# EAGLE design video_board_yis503 (EAGLE 7.5.0)
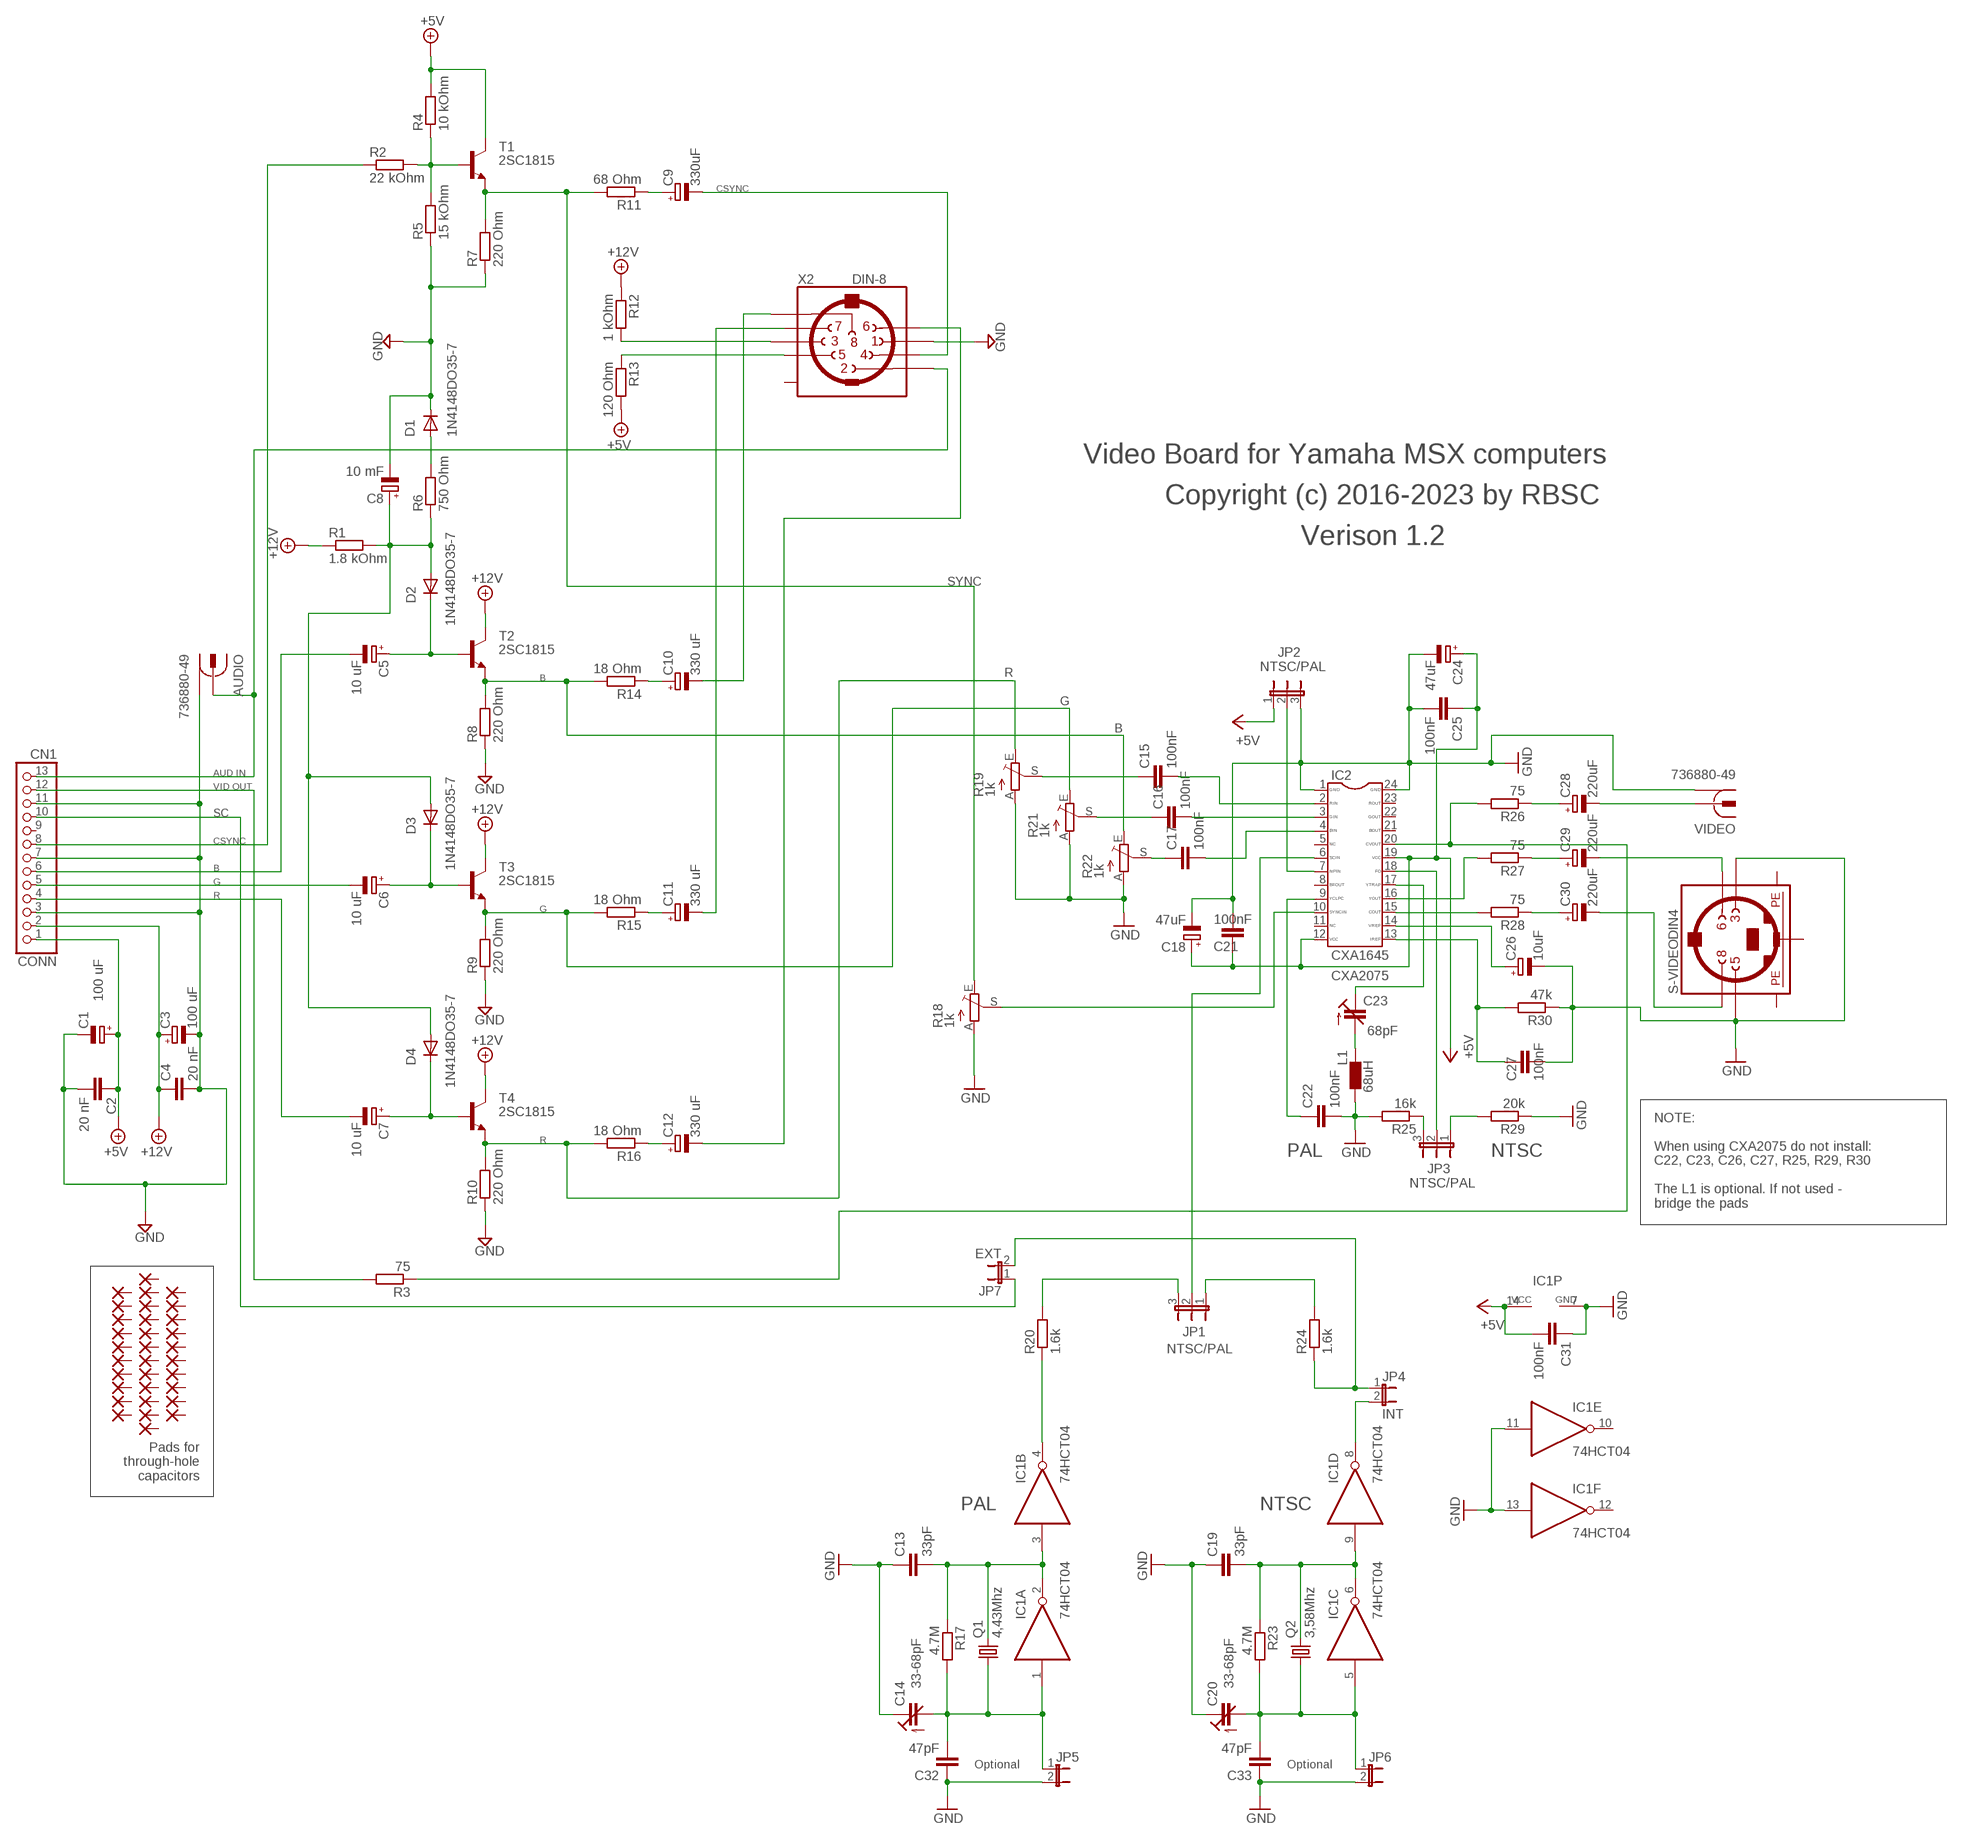
[diagram p0: schematic, sheet 1]

## Parts
AUDIO  736880-49  [736880-49]
C1  100 uF  CPOL-EUSMCD  [SMC_D]
C2  20 nF  C-EUC0805  [C0805]
C3  100 uF  CPOL-EUSMCD  [SMC_D]
C4  20 nF  C-EUC0805  [C0805]
C5  10 uF  CPOL-EUSMCB  [SMC_B]
C6  10 uF  CPOL-EUSMCB  [SMC_B]
C7  10 uF  CPOL-EUSMCB  [SMC_B]
C8  10 mF  CPOL-EUSMCB  [SMC_B]
C9  330uF  CPOL-EUSMCD  [SMC_D]
C10  330 uF  CPOL-EUSMCD  [SMC_D]
C11  330 uF  CPOL-EUSMCD  [SMC_D]
C12  330 uF  CPOL-EUSMCD  [SMC_D]
C13  33pF  C-EUC0805  [C0805]
C14  33-68pF  C-TRIMMTZ03  [CTRIMTZ03]
C15  100nF  C-EUC0805  [C0805]
C16  100nF  C-EUC0805  [C0805]
C17  100nF  C-EUC0805  [C0805]
C18  47uF  CPOL-EUSMCB  [SMC_B]
C19  33pF  C-EUC0805  [C0805]
C20  33-68pF  C-TRIMMTZ03  [CTRIMTZ03]
C21  100nF  C-EUC0805  [C0805]
C22  100nF  C-EUC0805  [C0805]
C23  68pF  C-TRIMMTZ03  [CTRIMTZ03]
C24  47uF  CPOL-EUSMCB  [SMC_B]
C25  100nF  C-EUC0805  [C0805]
C26  10uF  CPOL-EUSMCB  [SMC_B]
C27  100nF  C-EUC0805  [C0805]
C28  220uF  CPOL-EUSMCD  [SMC_D]
C29  220uF  CPOL-EUSMCD  [SMC_D]
C30  220uF  CPOL-EUSMCD  [SMC_D]
C31  100nF  C-EUC0805  [C0805]
C32  47pF  C-EUC0805  [C0805]
C33  47pF  C-EUC0805  [C0805]
CONN  CN1  PINHD-1X13  [1X13]
D1  1N4148DO35-7  DIODE-MINIMELF  [MINIMELF]
D2  1N4148DO35-7  DIODE-MINIMELF  [MINIMELF]
D3  1N4148DO35-7  DIODE-MINIMELF  [MINIMELF]
D4  1N4148DO35-7  DIODE-MINIMELF  [MINIMELF]
IC1  74HCT04  74HCT04D  [SO14]
IC2  CXA1645  [SOP24]
JP1  NTSC/PAL  JP2E  [JP2]
JP2  NTSC/PAL  JP2E  [JP2]
JP3  NTSC/PAL  JP2E  [JP2]
JP4  INT  JP1E  [JP1]
JP5  JP1E  [JP1]
JP6  JP1E  [JP1]
JP7  EXT  JP1E  [JP1]
L1  68uH  LL3230M  [L3230M]
P1  PADTH  [PADTH]
P2  PADTH  [PADTH]
P3  PADTH  [PADTH]
P4  PADTH  [PADTH]
P5  PADTH  [PADTH]
P6  PADTH  [PADTH]
P7  PADTH  [PADTH]
P8  PADTH  [PADTH]
P9  PADTH  [PADTH]
P10  PADTH  [PADTH]
P11  PADTH  [PADTH]
P12  PADTH  [PADTH]
P13  PADTH  [PADTH]
P14  PADTH  [PADTH]
P15  PADTH  [PADTH]
P16  PADTH  [PADTH]
P17  PADTH  [PADTH]
P18  PADTH  [PADTH]
P19  PADTH  [PADTH]
P20  PADTH  [PADTH]
P21  PADTH  [PADTH]
P22  PADTH  [PADTH]
P23  PADTH  [PADTH]
P24  PADTH  [PADTH]
P25  PADTH  [PADTH]
P26  PADTH  [PADTH]
P27  PADTH  [PADTH]
P28  PADTH  [PADTH]
P29  PADTH  [PADTH]
P30  PADTH  [PADTH]
P31  PADTH  [PADTH]
P32  PADTH  [PADTH]
Q1  4,43Mhz  CRYSTALHC49S  [HC49/S]
Q2  3,58Mhz  CRYSTALHC49S  [HC49/S]
R1  1.8 kOhm  R-EU_R0805  [R0805]
R2  22 kOhm  R-EU_R0805  [R0805]
R3  75  R-EU_R0805  [R0805]
R4  10 kOhm  R-EU_R0805  [R0805]
R5  15 kOhm  R-EU_R0805  [R0805]
R6  750 Ohm  R-EU_R0805  [R0805]
R7  220 Ohm  R-EU_R0805  [R0805]
R8  220 Ohm  R-EU_R0805  [R0805]
R9  220 Ohm  R-EU_R0805  [R0805]
R10  220 Ohm  R-EU_R0805  [R0805]
R11  68 Ohm  R-EU_R0805  [R0805]
R12  1 kOhm  R-EU_R0805  [R0805]
R13  120 Ohm  R-EU_R0805  [R0805]
R14  18 Ohm  R-EU_R0805  [R0805]
R15  18 Ohm  R-EU_R0805  [R0805]
R16  18 Ohm  R-EU_R0805  [R0805]
R17  4.7M  R-EU_R0805  [R0805]
R18  1k  TRIM_EU-CA6V  [CA6V]
R19  1k  TRIM_EU-CA6V  [CA6V]
R20  1.6k  R-EU_R0805  [R0805]
R21  1k  TRIM_EU-CA6V  [CA6V]
R22  1k  TRIM_EU-CA6V  [CA6V]
R23  4.7M  R-EU_R0805  [R0805]
R24  1.6k  R-EU_R0805  [R0805]
R25  16k  R-EU_R0805  [R0805]
R26  75  R-EU_R0805  [R0805]
R27  75  R-EU_R0805  [R0805]
R28  75  R-EU_R0805  [R0805]
R29  20k  R-EU_R0805  [R0805]
R30  47k  R-EU_R0805  [R0805]
S-VIDEO  DIN4  MINI_DIN_4  [M_DIN4]
T1  2SC1815  [TO92-ECB]
T2  2SC1815  [TO92-ECB]
T3  2SC1815  [TO92-ECB]
T4  2SC1815  [TO92-ECB]
VIDEO  736880-49  [736880-49]
X2  DIN-8  [DIN8]

## Nets
+5V: C1.+ C2.1 C18.+ C21.1 C24.+ C25.1 C31.2 CONN.1 IC1.14(P:VCC) IC2.12 IC2.19 JP2.1 R4.2 R13.2 T1.C
+12V: C3.+ C4.1 CONN.2 R1.1 R12.1 T2.C T3.C T4.C
GND: AUDIO.1 AUDIO.1@1 AUDIO.1@2 C1.- C2.2 C3.- C4.2 C8.- C13.1 C14.1(E) C18.- C19.1 C20.1(E) C21.2 C22.2 C24.- C25.2 C26.- C27.2 C31.1 C32.1 C33.1 CONN.3 CONN.7 CONN.11 D1.C IC1.7(P:GND) IC1.11(E:I) IC1.13(F:I) IC2.1 IC2.24 JP2.3 JP5.2 JP6.2 L1.2 R5.1 R7.1 R8.1 R9.1 R10.1 R18.A R19.A R21.A R22.A R25.2 R29.1 R30.1 S-VIDEO.3 S-VIDEO.5 VIDEO.1 VIDEO.1@1 VIDEO.1@2 X2.1
N$1: R10.2 R16.2 R19.E T4.E
N$2: C20.2(A) C33.2 IC1.5(C:I) JP6.1 Q2.1 R23.2
N$3: JP4.1 JP7.2 R24.1
N$4: CONN.8 R2.1
N$5: R8.2 R14.2 R22.E T2.E
N$6: C15.1 R19.S
N$7: C16.1 R21.S
N$8: IC1.4(B:O) R20.1
N$9: C23.2(A) L1.1
N$10: C19.2 IC1.6(C:O) IC1.9(D:I) Q2.2 R23.1
N$11: JP1.3 R20.2
N$12: C8.+ D2.A D3.A D4.A R1.2 R6.1
N$13: JP3.3 R25.1
N$14: IC2.7 JP2.2
N$15: JP3.1 R29.2
N$16: IC2.16 R27.2
N$17: JP1.1 R24.2
N$18: IC1.8(D:O) JP4.2
N$19: CONN.12 R3.2
N$24: C23.1(E) IC2.17
N$26: C12.- X2.6
N$27: C11.- X2.7
N$29: C6.+ D3.C T3.B
N$30: C10.- X2.8
N$31: D1.A R6.2
N$32: C6.- CONN.5
N$33: C5.- CONN.6
N$34: AUDIO.2 CONN.13 X2.2
N$35: C12.+ R16.1
N$36: R12.2 X2.3
N$37: R9.2 R15.2 R21.E T3.E
N$38: R13.1 X2.5
N$39: C7.+ D4.C T4.B
N$42: C7.- CONN.4
N$43: C5.+ D2.C T2.B
N$47: R2.2 R4.1 R5.2 T1.B
N$50: R7.2 R11.2 R18.E T1.E
N$51: C11.+ R15.1
N$52: C10.+ R14.1
N$53: C9.+ R11.1
N$54: C9.- X2.4
N$55: C17.1 R22.S
N$56: C16.2 IC2.3
N$57: C15.2 IC2.2
N$58: C17.2 IC2.4
N$59: C14.2(A) C32.2 IC1.1(A:I) JP5.1 Q1.1 R17.2
N$60: C13.2 IC1.2(A:O) IC1.3(B:I) Q1.2 R17.1
N$61: IC2.10 R18.S
N$63: IC2.6 JP1.2
N$64: IC2.20 R3.1 R26.2
N$65: C22.1 IC2.9
N$66: IC2.18 JP3.2
N$68: IC2.15 R28.2
N$69: C28.+ R26.1
N$70: C29.+ R27.1
N$71: C30.+ R28.1
N$72: C26.+ IC2.14
N$73: C27.1 IC2.13 R30.2
N$75: C28.- VIDEO.2
N$78: C29.- S-VIDEO.6
N$79: C30.- S-VIDEO.8
SC: CONN.10 JP7.1
Unconnected: CONN.9 IC1.10(E:O) IC1.12(F:O) IC2.5 IC2.8 IC2.11 IC2.21 IC2.22 IC2.23 P1.1(P) P2.1(P) P3.1(P) P4.1(P) P5.1(P) P6.1(P) P7.1(P) P8.1(P) P9.1(P) P10.1(P) P11.1(P) P12.1(P) P13.1(P) P14.1(P) P15.1(P) P16.1(P) P17.1(P) P18.1(P) P19.1(P) P20.1(P) P21.1(P) P22.1(P) P23.1(P) P24.1(P) P25.1(P) P26.1(P) P27.1(P) P28.1(P) P29.1(P) P30.1(P) P31.1(P) P32.1(P) X2.GND

## Notes on the sheet
- CSYNC
- Video Board for Yamaha MSX computers
- Copyright (c) 2016-2023 by RBSC
- Verison 1.2
- SYNC
- R
- B
- G
- B
- AUD IN
- VID OUT
- CSYNC
- B
- G
- R
- G
- CXA2075
- R
- PAL | NTSC
- NOTE:
  
  When using CXA2075 do not install:
  C22, C23, C26, C27, R25, R29, R30
  
  The L1 is optional. If not used -
  bridge the pads
- Pads for
  through-hole
  capacitors
- PAL | NTSC
- Optional | Optional

## Power pins joined to a net without a drawn wire
PE1: S-VIDEO.SH1(PE1)
PE2: S-VIDEO.SH2(PE2)
PE3: S-VIDEO.SH3(PE3)

## Library data of the parts
AUDIO VIDEO = con-conrad:736880-49: Cinch Connector ( RCA Jack ) Cinch-Einbaukupplung 90º 72345 Vernickelt BKL Electronic Source: Conrad <http://www.conrad.de/ce/de/product/736880>
C1 C3 C5-C12 = rcl:CPOL-EU: POLARIZED CAPACITOR, European symbol
C2 C4 = rcl:C-EU: CAPACITOR, European symbol
C13 C15-C17 C19 C21 C22 C25 C27 C31-C33 = rcl:C-EU: CAPACITOR, European symbol; OC_FARNELL: unknown
C14 C20 = rcl:C-TRIMM: Trimm capacitor; OC_FARNELL: unknown
C18 C24 C26 C28-C30 = rcl:CPOL-EU: POLARIZED CAPACITOR, European symbol; OC_FARNELL: unknown
C23 = rcl:C-TRIMM: Trimm capacitor
CONN = pinhead:PINHD-1X13: PIN HEADER
D1-D4 = diode:DIODE-: DIODE
IC1 = 74xx-eu:74*04: Hex INVERTER
IC2 = CXA1645M:CXA1645; OC_FARNELL: unknown
JP1-JP3 = jumper:JP2E: JUMPER
JP4-JP7 = jumper:JP1E: JUMPER
L1 = eagle-ltspice:L: INDUCTOR, European symbol; SPICEMODEL: NONE; SPICEPREFIX: L
P1-P32 = combopad:PADTH: THROUGH-HOLE PAD
Q1 Q2 = crystal:CRYSTAL: CRYSTAL; MF: MULTICOMP; MPN: HC49SM-3.6864-30-50-60-16-ATF; OC_FARNELL: 1667008; OC_NEWARK: unknown
R1 R2 R4-R16 = resistor:R-EU_: RESISTOR, European symbol
R3 R17 R20 R23-R30 = rcl:R-EU_: RESISTOR, European symbol; OC_FARNELL: unknown
R18 R19 R21 R22 = pot:TRIM_EU-: POTENTIOMETER; OC_FARNELL: unknown
S-VIDEO = mini_din:MINI_DIN_4
T1-T4 = transistor:2SC1815: NPN EPITAXIAL TRANSISTOR Source: TOSHIBA .. 2SC1815 1.pdf
X2 = din8:DIN-8: Female CONNECTOR 8 pins with shield, horizontal (DIN 41524)

## Board
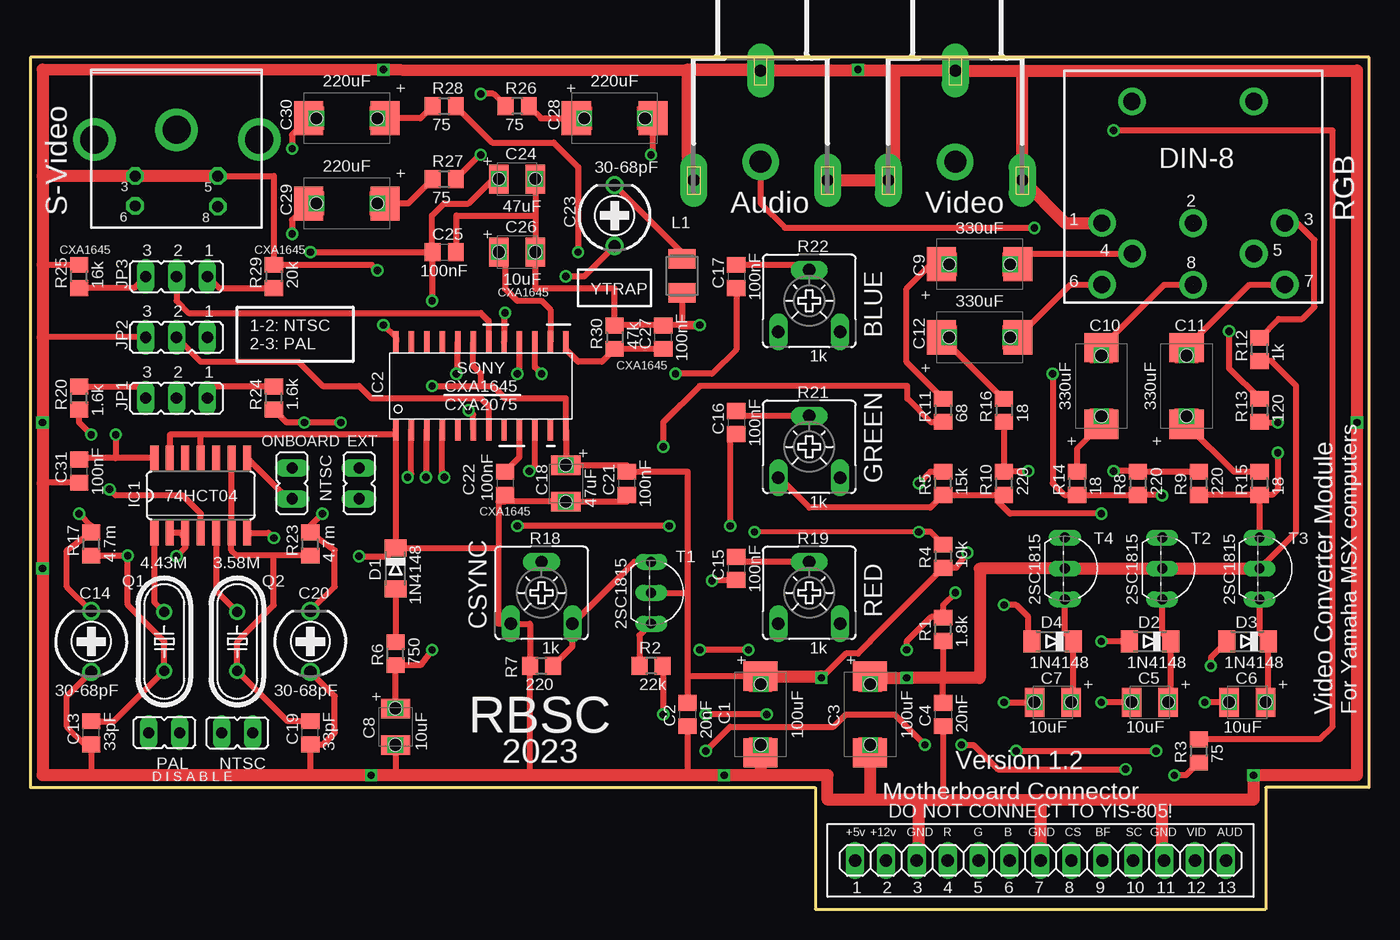
[diagram p1: board, top side]
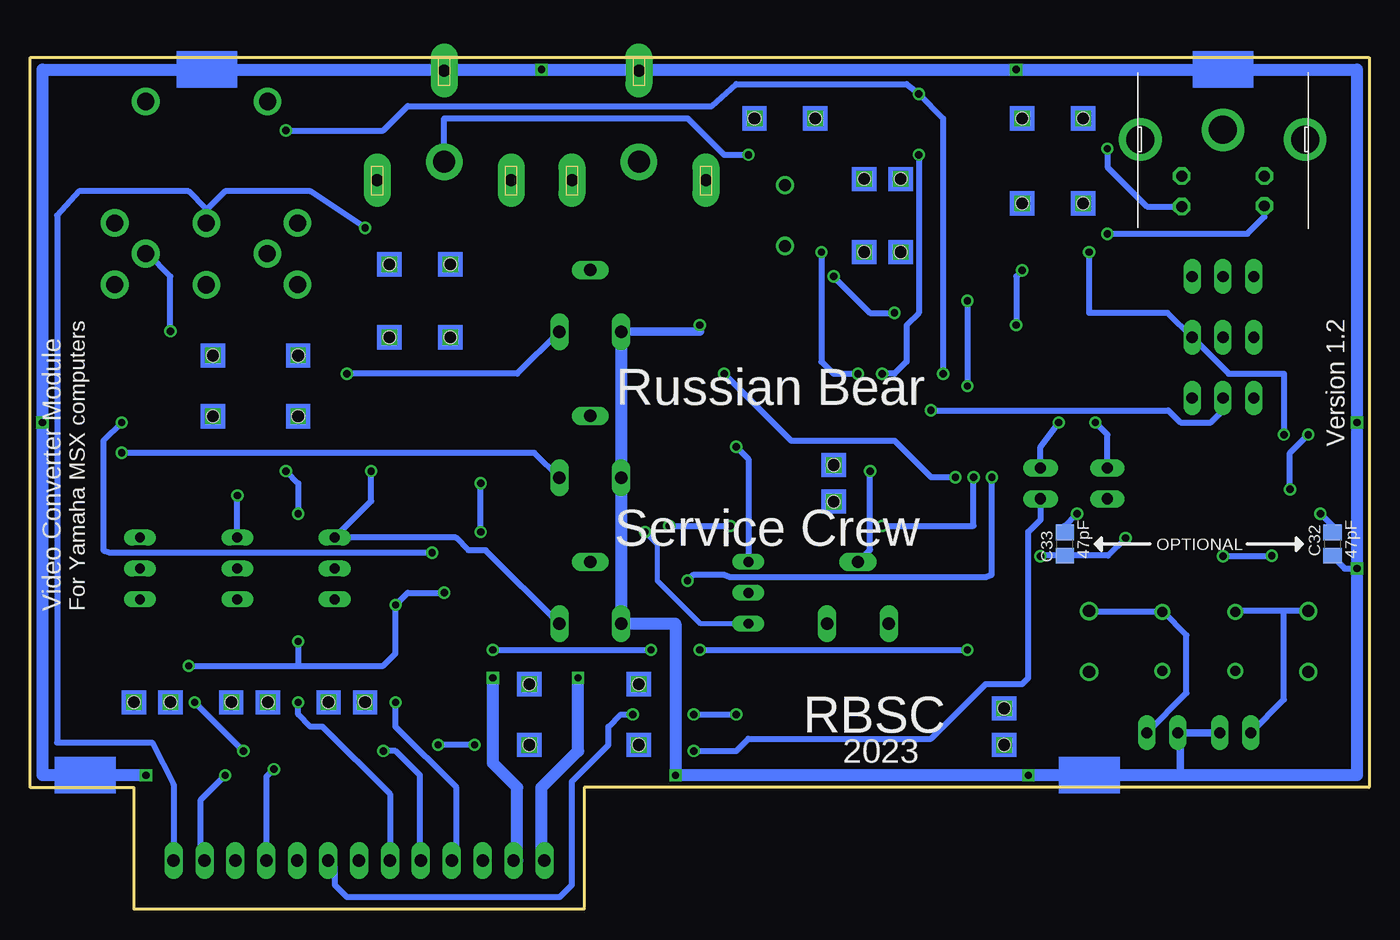
[diagram p2: board, bottom side, seen from below]

Size 110 x 70 mm. Coordinates in mm from the lower left corner, seen from the top.
Outline: 110,10 101.5,10 101.5,0 64.5,0 64.5,10 0,10 0,70 110,70 110,10
Copper layers (1*16): Top 0.035mm / dielectric 1.5mm / Bottom 0.035mm
Design rules "default *": minimum track width 10mil, minimum drill 24mil, track to track 8mil, track to pad 8mil, pad to pad 8mil, via to via 8mil, smd to smd 8mil, copper to edge 4mil, drill to drill 8mil, minimum pad ring 10mil, minimum via ring 8mil, stop-mask expansion 4mil, vias tented up to drill 24mil, thermal gap 10mil

### Footprints (pad centres in the part's own frame; a part is rotated, then mirrored left to right if it is on the bottom)
736880-49 = drill 1 pad 2.2 long: 1 -3.92,0; 1@1 5.08,-5.5; 1@2 5.08,5.5 | drill 1.8 pad 3: 2 3.58,0
SMC_D = smd 2.4 x 2.8: + -3.15,0; - 3.15,0
C0805 = smd 1.3 x 1.5: 1 -0.95,0; 2 0.95,0
SMC_B = smd 1.6 x 2.4: + -1.5,0; - 1.5,0
CTRIMTZ03 = drill 1: 1 0,2.5; 2 0,-2.5
1X13 = drill 1.016 long: 1 -15.24,0; 2 -12.7,0; 3 -10.16,0; 4 -7.62,0; 5 -5.08,0; 6 -2.54,0; 7 0,0; 8 2.54,0; 9 5.08,0; 10 7.62,0; 11 10.16,0; 12 12.7,0; 13 15.24,0
MINIMELF = smd 1.4 x 1.8: A 1.7,0; C -1.7,0
SO14 = smd 0.66 x 2.032: 1 -3.81,-3.073; 2 -2.54,-3.073; 3 -1.27,-3.073; 4 0,-3.073; 5 1.27,-3.073; 6 2.54,-3.073; 7 3.81,-3.073; 8 3.81,3.073; 9 2.54,3.073; 10 1.27,3.073; 11 0,3.073; 12 -1.27,3.073; 13 -2.54,3.073; 14 -3.81,3.073
SOP24 = smd 0.45 x 1.8: 1 -6.97,-3.6; 2 -5.7,-3.6; 3 -4.43,-3.6; 4 -3.16,-3.6; 5 -1.89,-3.6; 6 -0.62,-3.6; 7 0.65,-3.6; 8 1.92,-3.6; 9 3.19,-3.6; 10 4.46,-3.6; 11 5.73,-3.6; 12 7,-3.6; 13 7,3.6; 14 5.73,3.6; 15 4.46,3.6; 16 3.19,3.6; 17 1.92,3.6; 18 0.65,3.6; 19 -0.62,3.6; 20 -1.89,3.6; 21 -3.16,3.6; 22 -4.43,3.6; 23 -5.7,3.6; 24 -6.97,3.6
JP2 = drill 0.914 long: 1 -2.54,0; 2 0,0; 3 2.54,0
JP1 = drill 0.914 long: 1 0,-1.27; 2 0,1.27
L3230M = smd 1.6 x 2.2: 1 -1.4,0; 2 1.4,0
PADTH = drill 0.762 pad 1.27 square: 1 0,0 | hole 1.016: 0,0
HC49/S = drill 0.813: 1 -2.413,0; 2 2.413,0
R0805 = smd 1.3 x 1.5: 1 -0.95,0; 2 0.95,0
CA6V = drill 1.016 long: A -2.54,-2.54; E 2.54,-2.54; S 0,2.54
M_DIN4 = drill 0.9 pad 1.422 octagon: 3 -3.4,-3.75; 5 3.4,-3.75; 6 -3.4,-6.2; 8 3.4,-6.25 | drill 2.3 pad 3.5: SH1 6.8,-0.75; SH2 0,0.05; SH3 -6.75,-0.75
TO92-ECB = drill 0.813 long: B 2.54,0; C 0,0; E -2.54,0
DIN8 = drill 1.4 pad 2.286: 1 7.94,3.6; 2 0.46,3.61; 3 -7.07,3.6; 4 5.47,6.13; 5 -4.53,6.12; 6 7.94,8.68; 7 -7.07,8.68; 8 0.46,8.69; GND -4.53,-6.382; GNDEX 5.48,-6.382

### Placement (x,y rotation side)
AUDIO  60,65 270 top
C1  60,16 270 top
C2  54,16 270 top
C3  69,16 270 top
C4  75,16 270 top
C5  92,17 180 top
C6  100,17 180 top
C7  84,17 180 top
C8  30,15 270 top
C9  78,53 0 top
C10  88,43 90 top
C11  95,43 90 top
C12  78,47 0 top
C13  5,14.5 90 top
C14  5,22 180 top
C15  58,28 270 top
C16  58,40 270 top
C17  58,52 270 top
C18  44,35 270 top
C19  23,14.5 90 top
C20  23,22 180 top
C21  49,35 270 top
C22  39,35 270 top
C23  48,57 180 top
C24  40,60 0 top
C25  34,54 0 top
C26  40,54 0 top
C27  52,47 90 top
C28  48,65 0 top
C29  26,58 180 top
C30  26,65 180 top
C31  4,36 90 top
C32  3,30 90 bottom
C33  25,30 90 bottom
CONN  83,4 0 top
D1  30,28 270 top
D2  92,22 180 top
D3  100,22 180 top
D4  84,22 180 top
IC1  14,34 0 top
IC2  37,43 0 top
JP1  12,42 180 top
JP2  12,47 180 top
JP3  12,52 180 top
JP4  21.5,35 180 top
JP5  11,14.5 270 top
JP6  17,14.5 90 top
JP7  27,35 0 top
L1  53.55,52.05 270 top
P1  60,18.5 0 top
P2  60,13.5 0 top
P3  69,18.5 0 top
P4  69,13.5 0 top
P5  30,16.5 0 top
P6  30,13.5 0 top
P7  82.5,17 90 top
P8  85.5,17 90 top
P9  90.5,17 90 top
P10  93.5,17 90 top
P11  98.5,17 90 top
P12  44,33.5 0 top
P13  44,36.5 0 top
P14  23.5,65 90 top
P15  28.5,65 90 top
P16  45.5,65 90 top
P17  50.5,65 90 top
P18  23.5,58 90 top
P19  28.5,58 90 top
P20  101.5,17 90 top
P21  75.5,53 90 top
P22  88,45.5 180 top
P23  88,40.5 0 top
P24  80.5,47 90 top
P25  75.5,47 90 top
P26  80.5,53 90 top
P27  41.5,60 90 top
P28  38.5,54 90 top
P29  41.5,54 90 top
P30  38.5,60 90 top
P31  95,45.5 0 top
P32  95,40.5 0 top
Q1  11,22 270 top
Q2  17,22 270 top
R1  75,23 90 top
R2  51,20 180 top
R3  96,13 270 top
R4  75,29 270 top
R5  75,35 90 top
R6  30,21 90 top
R7  42,20 0 top
R8  91,35 270 top
R9  96,35 270 top
R10  80,35 90 top
R11  75,41 270 top
R12  101,46 90 top
R13  101,41 270 top
R14  86,35 270 top
R15  101,35 270 top
R16  80,41 270 top
R17  5,30 90 top
R18  42,26 0 top
R19  64,26 0 top
R20  4,42 90 top
R21  64,38 0 top
R22  64,50 0 top
R23  23,30 90 top
R24  20,42 90 top
R25  4,52 90 top
R26  40,66 180 top
R27  34,60 0 top
R28  34,66 0 top
R29  20,52 270 top
R30  48,47 270 top
S-VIDEO  12,64 0 top
T1  51,26 270 top
T2  93,28 270 top
T3  101,28 270 top
T4  85,28 270 top
VIDEO  76,65 270 top
X2  96,60 180 top

### Tracks (layer width: path | path; a pad name or v marks a point on that pad's centre or on a via)
+5V  (via drill 0.6)
  Top 0.5: C1.+ 54,19.15 | 54,19.15 C2.1 | T1.C 54,26 | 54,26 54,19.15 | 54,26 54,35.95 C21.1 49,36.5 C18.+ IC2.12 44,42 39,42 38,43 37,43 | IC1.14 7,37.07 | v65,19 67,21 68,21 69,22 69,22.05 R4.2 76.05,28.05 v77,29.3 | v7,39 7,37.07 | v23,54 C25.1 | IC2.19 36.38,44.62 37,44 37,43 | C25.1 33,54.05 33,57 34,58 36,58 38,60 C24.+ | C25.1 33,53.95 v33,50 | v33,43 37,43 | R13.2 101.05,40 v102.5,40 | 7,37.07 4.12,37.07 C31.2
  Top 1: C1.+ 65,19.15 v65,19
  Bottom 0.5: v7,39 7,44 11.54,44 JP2.1 16.54,49 23,49 v23,54 | v33,50 v33,43 | v102.5,40 104,38.5 104,29.5 103.5,29.3 v77,29.3
  Bottom 1: CONN.1 68,4.24 68,10 65,13 v65,19
+12V  (via drill 0.6)
  Top 0.406: C3.+ 69.5,19.15 69.5,19
  Top 0.5: C4.1 75,19 R1.1 | T3.C 104,31 104,43 101.95,45.05 R12.1 101.05,45
  Top 1: 69,19 69.5,19 v72,19 75,19 78,19 78,28 T4.C T2.C T3.C
  Bottom 1: CONN.2 70,4 70,10 72,12 v72,19
GND  (via drill 0.6)
  Top 0.406: 53.55,48 52,48 C27.2 | 48,48 R30.1 | 54,60 54,59.92
  Top 0.5: R25.2 1,52.95 | C8.- 30,11 | C2.2 54,11 | C24.- 41.5,57 | 41.5,57 C26.- 41.5,51 48,51 48,48 53.55,48 L1.2 | AUDIO.1@1 54,59.92 | 35,54 35,57 41.5,57 | S-VIDEO.5 20,60.25 R29.1 28.05,52.95 v28.5,52.5 | 39,33.5 C18.- 49,33.5 C21.2 | 38.46,29.7 38.46,33.5 39,33.5 | 41,20 41,11 | R7.1 41.05,23.46 R18.A 38.46,23.46 38.46,29.7 | C4.2 75,9 | D1.C 38.46,29.7 | IC2.1 30,39.4 30,39 | 30,39 D1.C | 30,39 14,39 | IC1.11 14,39 | 14,39 11.46,39 IC1.13 | JP2.3 1,47 | 1,35.05 1,35 1.05,35.05 C31.1 | 79.5,34.05 R5.1 73.95,33 64,33 61.54,35.46 R21.A | 79.5,34.05 R10.1 | R9.1 R8.1 90.95,36 v89,36 | v88,32.5 80.5,32.5 79.5,33.5 79.5,34.05 | v29,48 30.03,46.97 IC2.24 | 39,33.5 C22.2 | 23,11 C19.1 24.05,13.55 25,14.5 25,17.5 C20.1 | 5,11 C13.1 4.45,13.55 3,15 3,17.5 C14.1 | v27,29 29.3,29 D1.C | IC1.7 19.57,30.93 v20,30.5
  Top 0.7: v55,48 53.55,48
  Top 1: CONN.3 73,4 73,9 | 73,9 75,9 83,9 | 83,9 CONN.7 | CONN.11 93,4 93,9 | 93,9 83,9 | 73,9 69,9 | 69,9 65.5,9 65.5,11 60,11 | 1,60.25 S-VIDEO.3 S-VIDEO.5 | 1,60.25 1,52.95 1,47 v1,40 1,35 v1,28 1,11 5,11 23,11 v28,11 30,11 41,11 54,11 v57,11 60,11 | AUDIO.1 1,69 1,60.25 | 81.5,68.92 VIDEO.1 71,68.92 | 81.5,68.92 109,68.92 v109,40 109,11 v100.5,11 100.5,9 93,9 | C3.- 69,9 | C1.- 60,11 | 71,68.92 AUDIO.1 | AUDIO.1 60,69 54,69 54,60 | AUDIO.1@2 VIDEO.1@1 71,59.92 71,68.92 | C25.2 35,54 | R7.1 41,20 | 81.5,68.92 VIDEO.1@2 85.02,56.4 X2.1
  Bottom 0.5: 55,47.46 v55,48 | v89,36 88,35 v88,32.5 | v28.5,52.5 29,52 v29,48 | C32.1 3,29 2,28 v1,28 | v27,29 26.95,29.05 C33.1 21.45,29.05 v20,30.5
  Bottom 0.6: JP6.2 15.5,14.5 | 15.5,14.5 15.5,11 | JP5.2 15.5,14.5
  Bottom 0.7: R22.A 55,47.46
  Bottom 1: R22.A R21.A R19.A 57,23.46 v57,11 v28,11 15.5,11 1,11 v1,28 v1,40 1,69 v29,69 v68,69 109,69 v109,40 109,11 v100.5,11
N$1  (via drill 0.6)
  Top 0.5: R16.2 R10.2 81.95,35.95 v82,36
  Bottom 0.5: v82,36 82,33.54 T4.E 75.04,30.54 74,29.5 72.58,29.5 R19.E
N$2  (via drill 0.6)
  Top 0.5: 23.05,31 R23.2 | C20.2 25,26.5 25,29.5 R23.2 | IC1.5 15.27,26.14 Q2.1 | v24,32.5 23,31.5 R23.2
  Bottom 0.5: C20.2 22.91,24.41 Q2.1 16.91,24.41 15,22.5 15,17.77 JP6.1 | C33.2 25,31.5 v24,32.5
N$3  (via drill 0.6)
  Top 0.5: R24.1 21.05,40 v22.5,40 v25.5,40
  Bottom 0.5: JP7.2 27,38 v25.5,40 | JP4.1 21.5,39 v22.5,40
N$4  (via drill 0.6)
  Top 0.5: v60.5,16 v55.5,16 | R2.1 52,19.95 v52,16
  Bottom 0.5: CONN.8 85,3.46 85,2 84,1 66.5,1 65.5,2 65.5,10.5 62.5,13.5 62.5,15 61.5,16 v60.5,16 | v55.5,16 v52,16
N$5  (via drill 0.6)
  Top 0.5: v93,34 92.95,34.05 R8.2 R14.2 84.95,34.05 84,35 v84,44
  Bottom 0.5: T2.E v93,34 | R22.E 70,44 v84,44
N$6
  Top 0.5: R19.S 58,28.54 C15.1
N$7
  Top 0.5: R21.S 58,40.54 C16.1
N$8  (via drill 0.6)
  Top 0.5: IC1.4 14,32.5 12.5,34 7,34 v6.5,34.5 | v5,39 4,40 R20.1
  Bottom 0.5: v6.5,34.5 6.5,37.5 v5,39
N$9
  Top 0.5: C23.2 53.55,53.95 L1.1
N$10
  Top 0.5: IC1.9 IC1.6 16.5,30.89 16.5,29.5 16.95,29.05 20,29.05 | C19.2 21.14,15.45 Q2.2 17,22 20,25 20,29.05 | R23.1 20,29.05
N$11
  Top 0.5: R20.2 9.46,42.95 JP1.3
N$12  (via drill 0.6)
  Top 0.5: C8.+ R6.1 32.05,20.05 v33,21.3 | v76,26 75,25 R1.2 74.95,24 74,24 72,22 v72,21.3 | D3.A 97,20.7 v97,20 | D2.A v88,22 | D4.A 82,22.3 82,24 81,25 v80,25 | v59,21.3 v55,21.3
  Bottom 0.5: v76,26 79,26 v80,25 80,21 81,20 88,20 | v97,20 88,20 | v88,22 88,20 | v72,21.3 v59,21.3 | v55,21.3 v33,21.3
N$13
  Top 0.5: JP3.3 8.51,51.05 R25.1
N$14
  Top 0.5: JP2.2 14,45 22,45 24,43 27,43 28,42 37,42 37.65,41.35 IC2.7
N$15
  Top 0.5: JP3.1 15.49,51.05 R29.2
N$16  (via drill 0.6)
  Top 0.5: R27.2 36.95,62 v37,62 | v40,44 40.19,44.19 IC2.16
  Bottom 0.5: v37,62 37,49 38,48 38,45 39,44 v40,44
N$17
  Top 0.5: R24.2 14.54,42.95 JP1.1
N$18
  Top 0.5: JP4.2 20.65,34.23 IC1.8
N$19  (via drill 0.6)
  Top 0.5: R3.2 94.95,11 v94,11
  Bottom 0.5: CONN.12 96,4.3 96,9 v94,11
N$24  (via drill 0.6)
  Top 0.5: C23.1 45.5,52 v44,52 | v39,49 38.92,48.92 IC2.17
  Bottom 0.5: v44,52 41,49 v39,49
N$26
  Top 0.5: C12.- 85.47,51.32 X2.6
N$27
  Top 0.5: C11.- 100.17,51.32 X2.7
N$29
  Top 0.5: C6.+ 101.7,17.2 D3.C 101,22.7 T3.B
N$30
  Top 0.5: C10.- 93.16,51.31 X2.8
N$31
  Top 0.5: D1.A R6.2
N$32  (via drill 0.6)
  Top 0.5: v81,13 v92.5,13 | C6.- v96.5,17
  Bottom 0.5: CONN.5 78,4.08 78,11 80,13 v81,13 | v96.5,17 v92.5,13
N$33  (via drill 0.6)
  Top 0.5: C5.- v88,17
  Bottom 0.5: CONN.6 80.46,9.46 86,15 87,15 88,16 v88,17
N$34  (via drill 0.6)
  Top 0.5: AUDIO.2 60,58 62,56 v82.5,56
  Bottom 0.5: v82.5,56 87,59 94,59 95.54,57.46 X2.2 95.54,57.54 97,59 106,59 107.8,57 107.8,13.7 100,13.7 98.24,10.24 CONN.13
N$35
  Top 0.5: C12.+ 79.9,41.95 R16.1
N$36
  Top 0.5: R12.2 102.55,48.5 104.5,48.5 105.5,49.5 105.5,55 104.1,56.4 X2.3
N$37  (via drill 0.6)
  Top 0.5: R15.2 R9.2 | T3.E R15.2 | v102.5,37.5 102.5,34.5 102.05,34.05 R15.2
  Bottom 0.5: R21.E 68.58,37.5 v102.5,37.5
N$38  (via drill 0.6)
  Top 0.5: R13.1 98.5,44.45 v98.5,47.5
  Bottom 0.5: v98.5,47.5 98.5,52 100.38,53.88 X2.5
N$39
  Top 0.5: T4.B 85,22.7 D4.C 85.7,17.2 C7.+
N$42  (via drill 0.6)
  Top 0.5: v80,17 C7.-
  Bottom 0.5: CONN.4 75,4.38 75,10 80,15 v80,17
N$43
  Top 0.5: T2.B 93,22.7 D2.C 93.7,17.2 C5.+
N$47  (via drill 0.6)
  Top 0.406: v73,31 v59.5,31
  Top 0.5: R4.1 73.95,31 v73,31 | v73,35 73.95,35.95 R5.2 | T1.B 50.05,22.51 R2.2
  Bottom 0.406: v59.5,31 58.5,30 58.5,27 55,23.5 51.04,23.5 T1.B
  Bottom 0.5: v73,31 v73,35
N$50  (via drill 0.6)
  Top 0.5: R7.2 44.54,21.59 R18.E 49.62,28.54 T1.E | v52,38 52,40 55,43 72.05,43 72.05,41.95 74,40 74.95,40 R11.2
  Bottom 0.5: v52,38 51,37 T1.E
N$51
  Top 0.5: C11.+ 98.9,35.95 R15.1
N$52
  Top 0.5: C10.+ 86,37.85 R14.1
N$53
  Top 0.5: R11.1 72,44.95 72,51 74,53 C9.+
N$54
  Top 0.5: C9.- 82.02,53.87 X2.4
N$55
  Top 0.5: R22.S 63.59,52.95 C17.1
N$56  (via drill 0.6)
  Top 0.5: C16.2 57.5,38.55 v57.5,31.5 | v52.5,31.5 v40,31.5 | v32.5,35.5 32.57,35.57 IC2.3
  Bottom 0.5: v57.5,31.5 v52.5,31.5 | v40,31.5 32.5,31.5 v32.5,35.5
N$57  (via drill 0.6)
  Top 0.5: C15.2 57.95,27 v56,27 | v31,35.5 31.3,35.8 IC2.2
  Bottom 0.5: v56,27 55.5,27.5 53,27.5 52.5,27.3 31.5,27.3 31,27.5 v31,35.5
N$58  (via drill 0.6)
  Top 0.5: C17.2 58,46 56,44 v53,44 | v34,35.5 33.84,35.66 IC2.4
  Bottom 0.5: v53,44 47.5,38.5 39,38.5 36,35.5 v34,35.5
N$59  (via drill 0.6)
  Top 0.5: C14.2 3,26.5 3,29.5 R17.2 | R17.2 5,31 | IC1.1 10.19,25.22 Q1.1 | v4,32.5 5,31.5 R17.2
  Bottom 0.5: C14.2 7,24.5 | 7,24.5 10.91,24.5 Q1.1 | C32.2 3,31.5 v4,32.5 | JP5.1 7,17.23 7,24.5
N$60  (via drill 0.6)
  Top 0.5: IC1.3 IC1.2 11.5,30.89 | C13.2 6.86,15.45 Q1.2 11,22 8,25 v8,29.05 R17.1 | 12.5,30.7 IC1.3 | v12,29 12.73,29.73 IC1.3
  Bottom 0.5: v8,29.05 8.05,29 v12,29
N$61  (via drill 0.6)
  Top 0.5: v41,36 41.46,36.46 IC2.10
  Bottom 0.5: R18.S 41,29.54 v41,36
N$63  (via drill 0.6)
  Top 0.5: IC2.6 36.38,40.62 v36,41
  Bottom 0.5: v36,41 16.5,41 15.5,40 13,40 12,41 JP1.2
N$64  (via drill 0.6)
  Top 0.5: R3.1 96.05,14 106,14 107,15 107,64 v89,64 | R26.2 38.05,67 v37,67 | v35,44 35.11,44.11 IC2.20
  Bottom 0.5: v89,64 81,64 79,66 54,66 52,67.8 38,67.8 v37,67 35,65 v35,44
N$65
  Top 0.5: C22.1 40.19,37.14 IC2.9
N$66
  Top 0.5: JP3.2 12,50 13,49 37,49 37.65,48.35 IC2.18
N$68  (via drill 0.6)
  Top 0.5: R28.2 37.95,63 43,63 45,61 v45,54 | v42,44 41.46,44.54 IC2.15
  Bottom 0.5: v45,54 45,45 44,44 v42,44
N$69
  Top 0.5: R26.1 41.95,65 C28.+
N$70
  Top 0.5: R27.1 31.05,58 C29.+
N$71
  Top 0.5: R28.1 32.05,65 C30.+
N$72
  Top 0.5: C26.+ 39,53.5 39,51 40,50 42,50 42.73,49.27 IC2.14
N$73
  Top 0.5: C27.1 R30.2 46.95,45 45,45 44,46 IC2.13
N$75  (via drill 0.6)
  Top 0.5: v51,62 51.15,62.15 C28.-
  Bottom 0.5: VIDEO.2 76,65 56,65 53,62 v51,62
N$78  (via drill 0.6)
  Top 0.5: C29.- 21.5,56.65 v21.5,55.5
  Bottom 0.5: v21.5,55.5 10,55.5 8.6,56.9 S-VIDEO.6
N$79  (via drill 0.6)
  Top 0.5: C30.- 21.5,63.65 v21.5,62.5
  Bottom 0.5: v21.5,62.5 21.5,61 18.25,57.75 S-VIDEO.8
SC  (via drill 0.6)
  Top 0.5: v55.5,13 57.5,15 66,15 67,16 71,16 v73.5,13.5 | v76.5,13.5 77.5,13.5 79.5,11.5 v90,11.5
  Bottom 0.5: JP7.1 27,32 28,31 28,19 28.5,18.5 31.5,18.5 36,14 51,14 52,13 v55.5,13 | v73.5,13.5 v76.5,13.5 | v90,11.5 90.62,10.88 CONN.10
(copper drawn outside any net)
  shapes: Bottom area x36

### Text on the board
tNames: 220uF | 220uF | + | R28 | R26 | + | C30 | 75 | 75 | C28 | + | C24 | RGB | 220uF | R27 | 30-68pF | + | Audio | Video | 75 | 47uF | S-Video | C29 | + | C26 | C23 | C25 | 330uF | CXA1645 | CXA1645 | R22 | 100nF | 10uF | C9 | R25 | 16k | JP3 | R29 | 20k | CXA1645 | C17 | + | YTRAP | 100nF | 330uF | 1-2: NTSC | BLUE | C10 | C11 | JP2 | 2-3: PAL | R30 | 47k | C27 | C12 | CXA1645 | 100nF | 1k | + | R12 | 1k | SONY | IC2 | CXA1645 | R21 | R20 | JP1 | R24 | 1.6k | CXA2075 | 330uF | 330uF | 1.6k | R11 | 68 | R16 | 18 | R13 | 120 | C16 | + | + | ONBOARD | EXT | 100nF | + | C31 | GREEN | 100nF | C22 | C18 | C21 | R5 | 15k | R10 | 220 | R14 | 18 | R8 | 220 | R9 | 220 | R15 | 18 | IC1 | 74HCT04 | NTSC | 100nF | CXA1645 | 47uF | 100nF | 1k | T4 | T2 | T3 | R18 | R19 | R17 | R23 | 4.7m | 4.43M | 3.58M | 4.7m | T1 | R4 | 10k | D1 | C15 | Q1 | Q2 | 100nF | C14 | C20 | 1N4148 | 2SC1815 | 2SC1815 | 2SC1815 | RED | CSYNC | 2SC1815 | D4 | D2 | D3 | R1 | 1k | R2 | 1k | 1.8k | 1N4148 | 1N4148 | 1N4148 | R6 | 750 | + | + | R7 | 220 | 22k | C7 | + | C5 | + | C6 | + | 30-68pF | 30-68pF | + | C1 | Video Converter Module | For Yamaha MSX computers | C2 | C3 | C4 | C8 | RBSC | 2023 | 20nF | 100uF | 100uF | 20nF | 10uF | 10uF | 10uF | C13 | 33pF | C19 | 33pF | 10uF | PAL | R3 | 75 | NTSC | Version 1.2 | D I S A B L E | Motherboard Connector | DO NOT CONNECT TO YIS-805! | +5v | +12v | GND | R | G | B | GND | CS | BF | SC | GND | VID | AUD | 1 | 2 | 3 | 4 | 5 | 6 | 7 | 8 | 9 | 10 | 11 | 12 | 13
bNames: Version 1.2 | Russian Bear | 47pF | 47pF | Service Crew | C32 | OPTIONAL | C33 | For Yamaha MSX computers | Video Converter Module | 2023 | RBSC